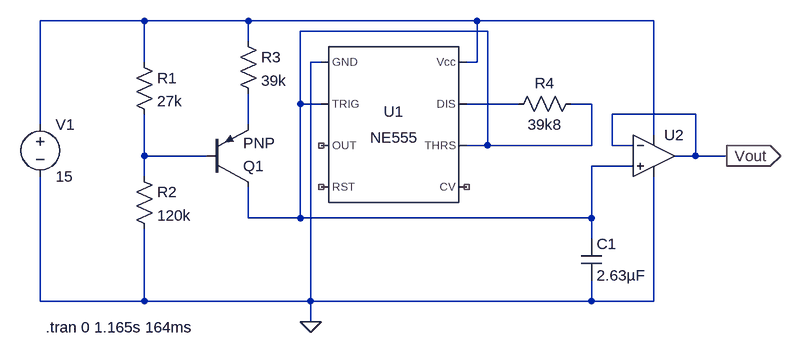
[diagram p0: schematic 555-Sawtooth-Oscillator.asc]
555-Sawtooth-Oscillator.asc, the LTspice schematic file:
Version 4
SHEET 1 880 680
WIRE -432 -32 -592 -32
WIRE -272 -32 -432 -32
WIRE 80 -32 -272 -32
WIRE 352 -32 80 -32
WIRE 96 -16 -192 -16
WIRE -272 0 -272 -32
WIRE -432 32 -432 -32
WIRE -160 32 -176 32
WIRE 80 32 80 -32
WIRE 80 32 64 32
WIRE -192 96 -192 -16
WIRE -160 96 -192 96
WIRE 144 96 64 96
WIRE 256 96 224 96
WIRE 416 112 288 112
WIRE -592 128 -592 -32
WIRE -272 128 -272 80
WIRE 352 144 352 -32
WIRE 96 160 96 -16
WIRE 96 160 64 160
WIRE 256 160 256 96
WIRE 256 160 96 160
WIRE 288 160 288 112
WIRE 320 160 288 160
WIRE -432 176 -432 112
WIRE -336 176 -432 176
WIRE 416 176 416 112
WIRE 416 176 384 176
WIRE 464 176 416 176
WIRE 320 192 256 192
WIRE -432 208 -432 176
WIRE -272 272 -272 224
WIRE -192 272 -192 96
WIRE -192 272 -272 272
WIRE 256 272 256 192
WIRE 256 272 -192 272
WIRE 256 304 256 272
WIRE -592 400 -592 208
WIRE -432 400 -432 288
WIRE -432 400 -592 400
WIRE -176 400 -176 32
WIRE -176 400 -432 400
WIRE 256 400 256 368
WIRE 256 400 -176 400
WIRE 352 400 352 208
WIRE 352 400 256 400
WIRE -176 432 -176 400
FLAG -176 432 0
FLAG 464 176 Vout
IOPIN 464 176 Out
SYMBOL Misc\\NE555 -48 128 R0
SYMATTR InstName U1
SYMBOL voltage -592 112 R0
WINDOW 123 0 0 Left 0
WINDOW 39 0 0 Left 0
SYMATTR InstName V1
SYMATTR Value 15
SYMBOL OpAmps\\UniversalOpAmp 352 176 R0
SYMATTR InstName U2
SYMBOL cap 240 304 R0
SYMATTR InstName C1
SYMATTR Value 2.63µF
SYMBOL res -288 -16 R0
SYMATTR InstName R3
SYMATTR Value 39k
SYMBOL res -448 16 R0
SYMATTR InstName R1
SYMATTR Value 27k
SYMBOL res -448 192 R0
SYMATTR InstName R2
SYMATTR Value 120k
SYMBOL res 240 80 R90
WINDOW 0 0 56 VBottom 2
WINDOW 3 32 56 VTop 2
SYMATTR InstName R4
SYMATTR Value 39k8
SYMBOL pnp -336 224 M180
SYMATTR InstName Q1
TEXT -584 440 Left 2 !.tran 0 1.165s 164ms

The netlist it stands for:
* 555-Sawtooth-Oscillator.asc
XU1 0 N002 NC_01 NC_02 NC_03 N002 N003 N001 NE555  ; pins GND TRIG OUT RST CV THRS DIS Vcc
V1 N001 0 15
XU2 N002 Vout N001 0 Vout level1 Avol=1Meg GBW=10Meg Vos=0 En=0 Enk=0 In=0 Ink=0 Rin=500Meg  ; pins In+ In- V+ V- OUT
C1 N002 0 2.63µF
R3 N001 N004 39k
R1 N001 N005 27k
R2 N005 0 120k
R4 N002 N003 39k8
Q1 N002 N005 N004 0 PNP
.model NPN NPN
.model PNP PNP
.lib standard.bjt
.tran 0 1.165s 164ms
.lib NE555.sub
.lib UniversalOpAmp1.lib
.backanno
.end